# EasyEDA schematic Schematic (EASYEDA).json
TITLE: Sheet_1; REV: 1.0; Date: 2026-01-15; Sheet: 1/1; Drawn By: fabiokunz2109; Company: Your Company
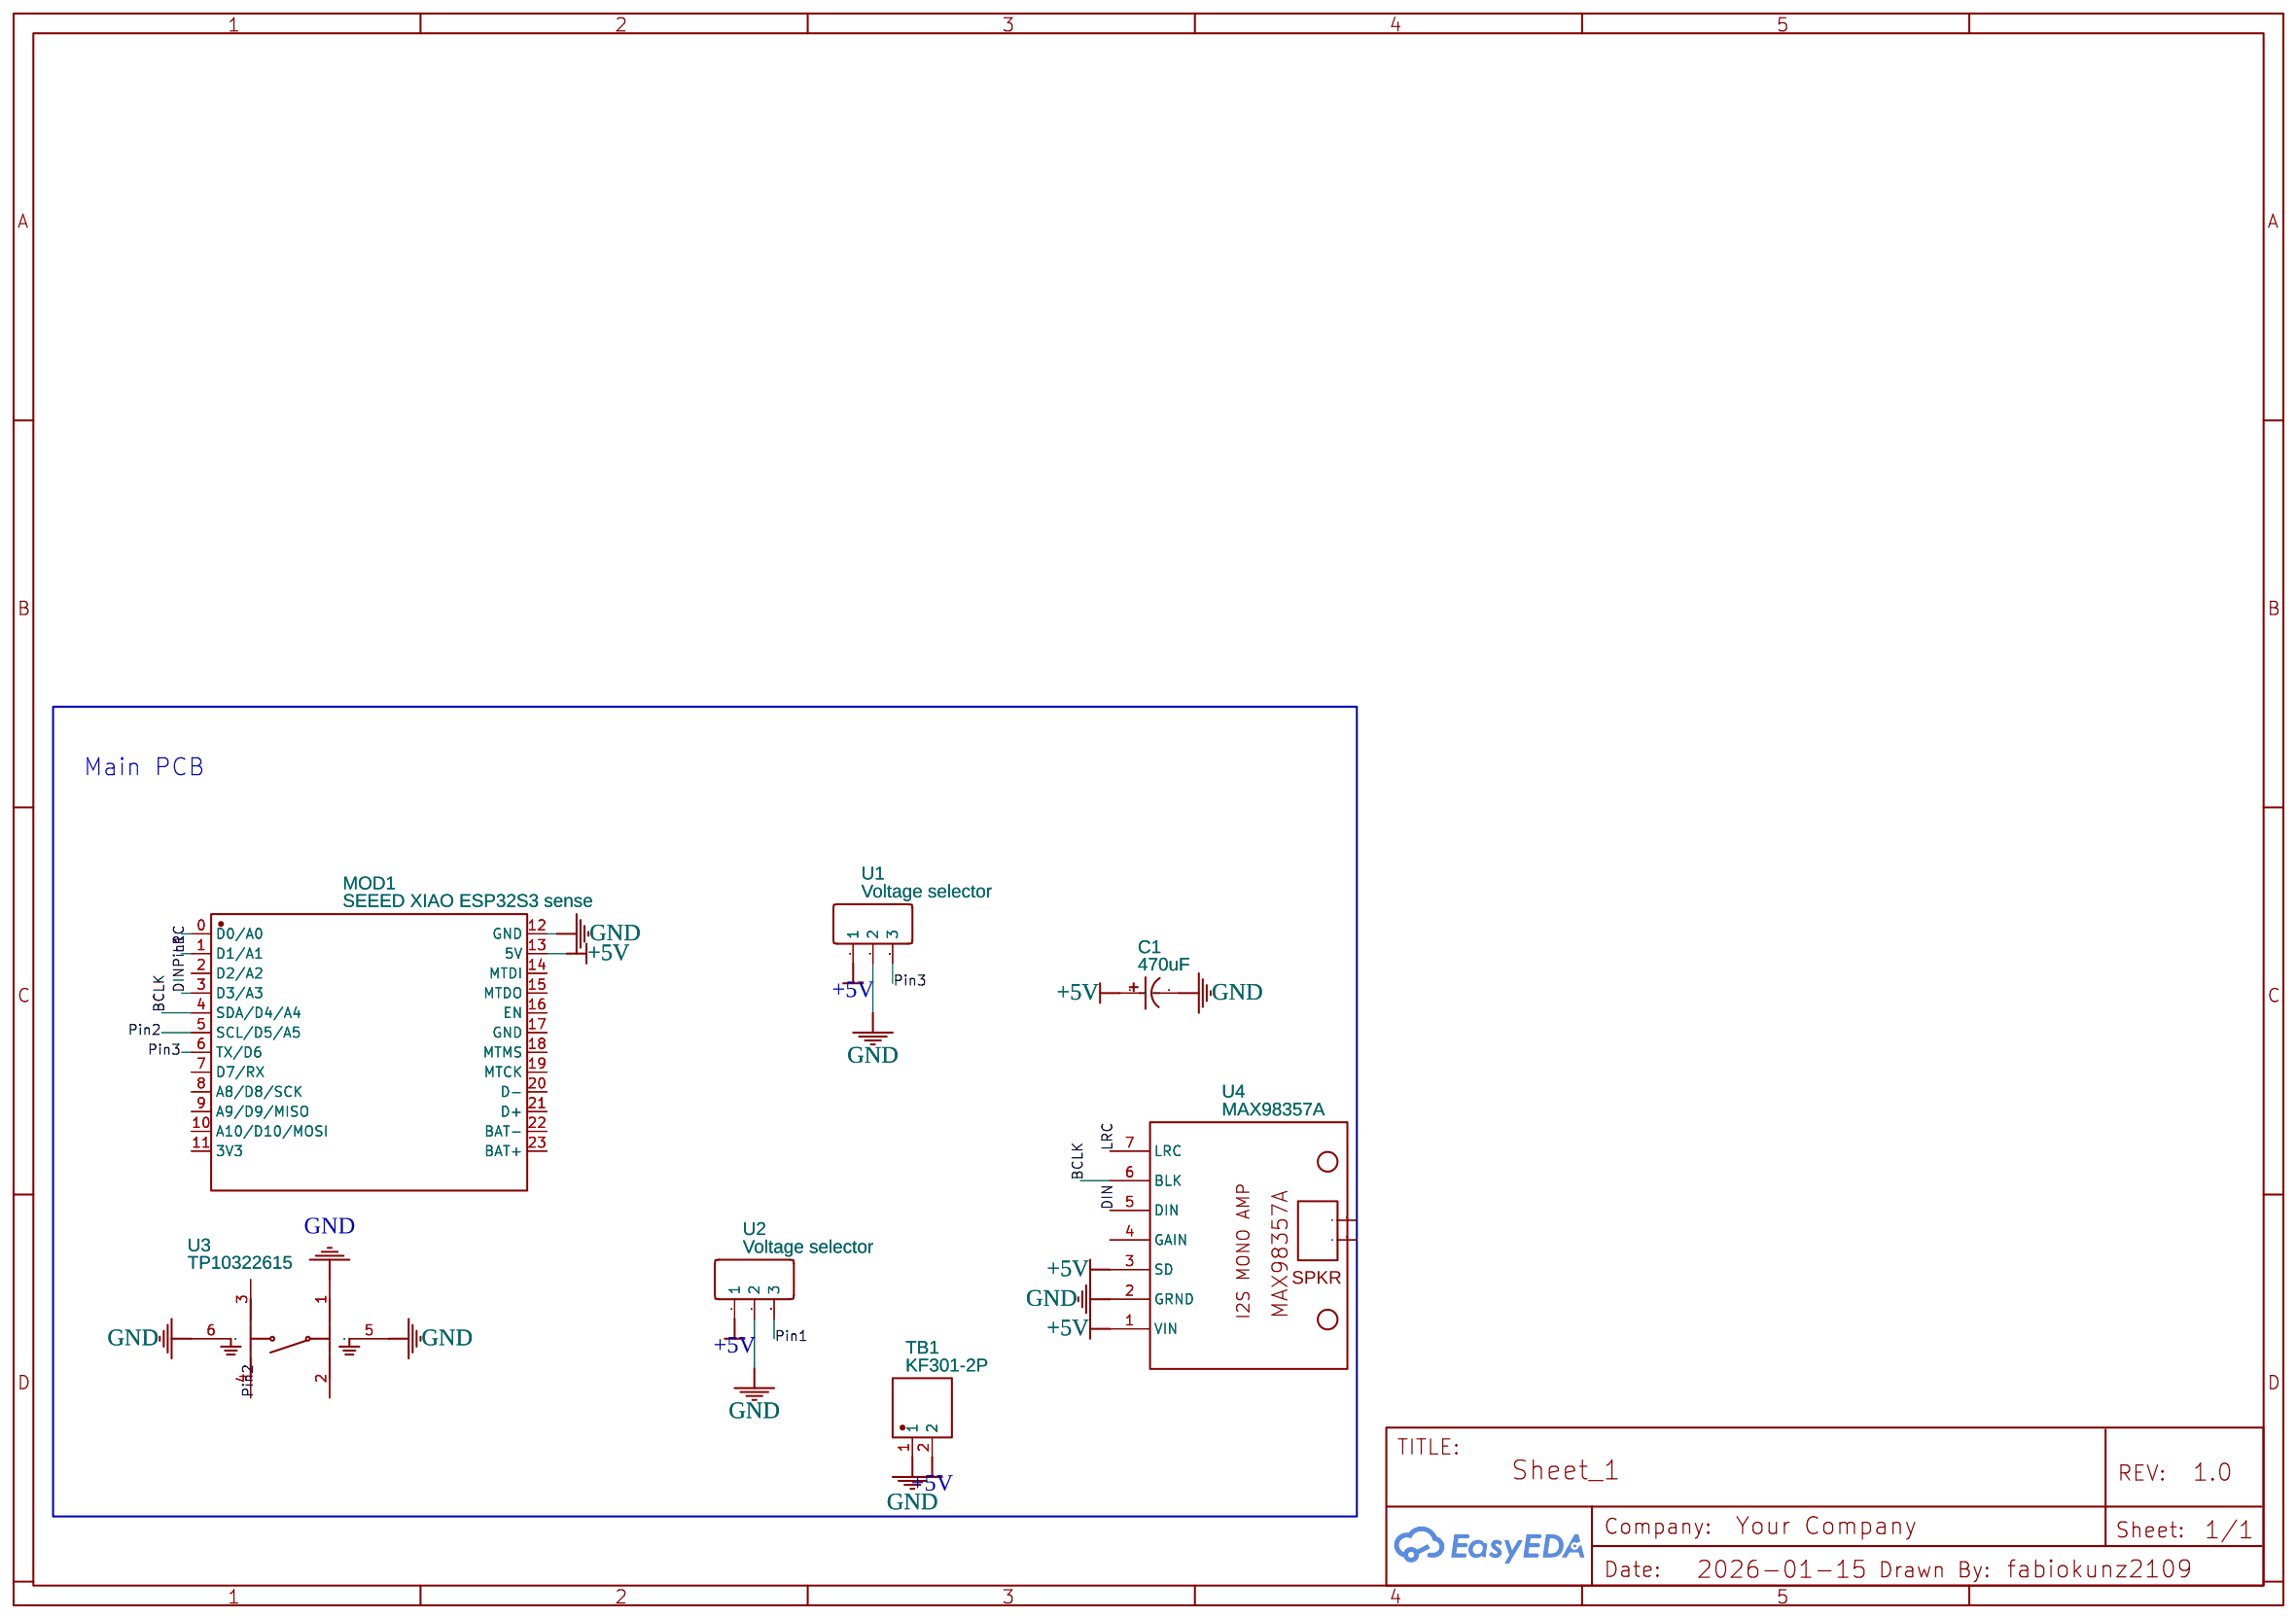
[diagram p0: schematic sheet]

## Parts
C1  470uF  [470UF 10V FLAT]
MOD1  SEEED XIAO ESP32S3 sense  [SEEEDUINO XIAO ESP32S3 SENSE]
TB1  KF301-2P  [KF301-2P]
U1  Voltage selector  [KF301-3P]
U2  Voltage selector  [KF301-3P]
U3  TP10322615  [SW-SMD_ROCPUSWITCHES_TP1032]
U4  MAX98357A  [COMM-TH_7P-L18.6-W17.5-P2.54_MAX98357A]

## Library data of the parts
C1 = 470uF 10V Flat 6.3x12: Contributor: Mr_HaleYa
MOD1 = SEEED XIAO ESP32S3 sense: Contributor: benzsttb
TB1 = KF301-2P: Contributor: KSM_MA
U1 U2 = Header-Male-2.54-1x3-2-1-Jumper: Contributor: amiragarcia
U3 = TP10322615: Contributor: lcsc; Supplier: LCSC; Supplier Part: C2999325; Manufacturer: ROCPU Switches(台普); JLCPCB Part Class: Extended Part
U4 = MAX98357A COPY: Contributor: Jian James

## Nets
+5V: C1.1 MOD1.13(5V) TB1.2 U1.1 U2.1 U4.1(VIN) U4.3(SD)
GND: C1.2 MOD1.12(GND) TB1.1 U1.2 U2.2 U3.1 U3.5 U3.6 U4.2(GRND)
BCLK: MOD1.4(SDA/D4/A4) U4.6(BLK)
DIN: MOD1.3(D3/A3) U4.5(DIN)
LRC: MOD1.1(D1/A1) U4.7(LRC)
Pin1: MOD1.0(D0/A0) U2.3
Pin2: MOD1.5(SCL/D5/A5) U3.4
Pin3: MOD1.6(TX/D6) U1.3

Not connected (* = marked no-connect by the designer): MOD1 2(D2/A2) 7(D7/RX) 8(A8/D8/SCK) 9(A9/D9/MISO) 10(A10/D10/MOSI) 11(3V3) 14(MTDI) 15(MTDO) 16(EN) 17(GND) 18(MTMS) 19(MTCK) 20(D-) 21(D+) 22(BAT-) 23(BAT+); U3 2 3; U4 4(GAIN)

## Notes on the sheet
- Main PCB
